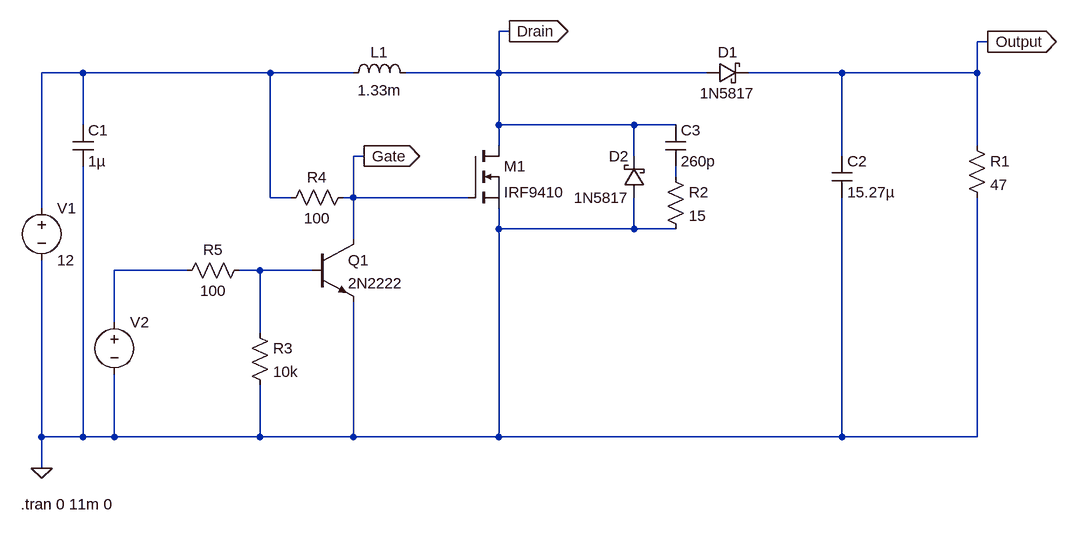
[diagram p0: schematic boost_converter_1.asc]
boost_converter_1.asc, the LTspice schematic file:
Version 4.1
SHEET 1 1856 1000
WIRE 336 48 320 48
WIRE 1072 64 1056 64
WIRE -320 112 -384 112
WIRE -32 112 -320 112
WIRE 96 112 -32 112
WIRE 320 112 320 48
WIRE 320 112 176 112
WIRE 640 112 320 112
WIRE 848 112 704 112
WIRE 1056 112 1056 64
WIRE 1056 112 848 112
WIRE -320 192 -320 112
WIRE 320 192 320 112
WIRE 528 192 320 192
WIRE 592 192 528 192
WIRE 320 224 320 192
WIRE 1056 224 1056 112
WIRE 112 240 96 240
WIRE 528 240 528 192
WIRE 848 240 848 112
WIRE 592 272 592 256
WIRE -32 304 -32 112
WIRE 0 304 -32 304
WIRE 96 304 96 240
WIRE 96 304 80 304
WIRE 272 304 96 304
WIRE -384 320 -384 112
WIRE 320 352 320 320
WIRE 528 352 528 304
WIRE 528 352 320 352
WIRE 592 352 528 352
WIRE 96 368 96 304
WIRE -160 416 -272 416
WIRE -48 416 -80 416
WIRE 32 416 -48 416
WIRE -272 496 -272 416
WIRE -48 512 -48 416
WIRE -384 672 -384 400
WIRE -320 672 -320 256
WIRE -320 672 -384 672
WIRE -272 672 -272 576
WIRE -272 672 -320 672
WIRE -48 672 -48 592
WIRE -48 672 -272 672
WIRE 96 672 96 464
WIRE 96 672 -48 672
WIRE 320 672 320 352
WIRE 320 672 96 672
WIRE 848 672 848 304
WIRE 848 672 320 672
WIRE 1056 672 1056 304
WIRE 1056 672 848 672
WIRE -384 720 -384 672
FLAG -384 720 0
FLAG 336 48 Drain
IOPIN 336 48 Out
FLAG 1072 64 Output
IOPIN 1072 64 Out
FLAG 112 240 Gate
IOPIN 112 240 Out
SYMBOL cap -336 192 R0
SYMATTR InstName C1
SYMATTR Value 1µ
SYMBOL ind 80 128 R270
WINDOW 0 32 56 VTop 2
WINDOW 3 5 56 VBottom 2
SYMATTR InstName L1
SYMATTR Value 1.33m
SYMATTR SpiceLine Ipk=0 Rser=0 Rpar=0 Cpar=0
SYMBOL nmos 272 224 R0
SYMATTR InstName M1
SYMATTR Value IRF9410
SYMBOL cap 832 240 R0
SYMATTR InstName C2
SYMATTR Value 15.27µ
SYMBOL schottky 640 128 R270
WINDOW 0 32 32 VTop 2
WINDOW 3 0 32 VBottom 2
SYMATTR InstName D1
SYMATTR Value 1N5817
SYMBOL res 1040 208 R0
SYMATTR InstName R1
SYMATTR Value 47
SYMBOL voltage -384 304 R0
WINDOW 123 0 0 Left 0
WINDOW 39 0 0 Left 0
SYMATTR InstName V1
SYMATTR Value 12
SYMBOL voltage -272 480 R0
WINDOW 3 24 44 Invisible 2
WINDOW 123 0 0 Left 0
WINDOW 39 0 0 Left 0
SYMATTR Value PULSE(3.3 0 0 0 0 33u 66.67u)
SYMATTR InstName V2
SYMBOL schottky 544 304 R180
WINDOW 0 24 64 Left 2
WINDOW 3 24 0 Left 2
SYMATTR InstName D2
SYMATTR Value 1N5817
SYMBOL res 576 256 R0
SYMATTR InstName R2
SYMATTR Value 15
SYMBOL cap 576 192 R0
SYMATTR InstName C3
SYMATTR Value 260p
SYMBOL res 96 288 R90
WINDOW 0 0 56 VBottom 2
WINDOW 3 32 56 VTop 2
SYMATTR InstName R4
SYMATTR Value 100
SYMBOL npn 32 368 R0
SYMATTR InstName Q1
SYMATTR Value 2N2222
SYMBOL res -64 400 R90
WINDOW 0 0 56 VBottom 2
WINDOW 3 32 56 VTop 2
SYMATTR InstName R5
SYMATTR Value 100
SYMBOL res -64 496 R0
SYMATTR InstName R3
SYMATTR Value 10k
TEXT -416 776 Left 2 !.tran 0 11m 0

The netlist it stands for:
* boost_converter_1.asc
C1 N001 0 1µ
L1 N001 Drain 1.33m Ipk=0 Rser=0 Rpar=0 Cpar=0
M1 Drain Gate 0 0 IRF9410
C2 Output 0 15.27µ
D1 Drain Output 1N5817
R1 Output 0 47
V1 N001 0 12
V2 N003 0 PULSE(3.3 0 0 0 0 33u 66.67u)
D2 0 Drain 1N5817
R2 N002 0 15
C3 Drain N002 260p
R4 Gate N001 100
Q1 Gate N004 0 0 2N2222
R5 N004 N003 100
R3 N004 0 10k
.model D D
.lib standard.dio
.model NPN NPN
.model PNP PNP
.lib standard.bjt
.model NMOS NMOS
.model PMOS PMOS
.lib standard.mos
.tran 0 11m 0
.backanno
.end